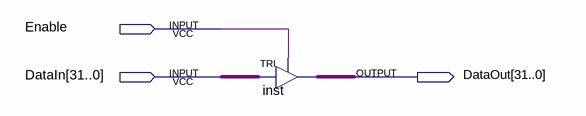
[diagram p0: schematic sheet]
// Quartus schematic tri_state_buffer.bdf as structural Verilog: 1 symbols, 3 pins
module tri_state_buffer (
  input  Enable,
  input  [31:0] DataIn,
  output [31:0] DataOut
);

  TRI inst[31:0] (.IN(DataIn), .OE(Enable), .OUT(DataOut));
endmodule
